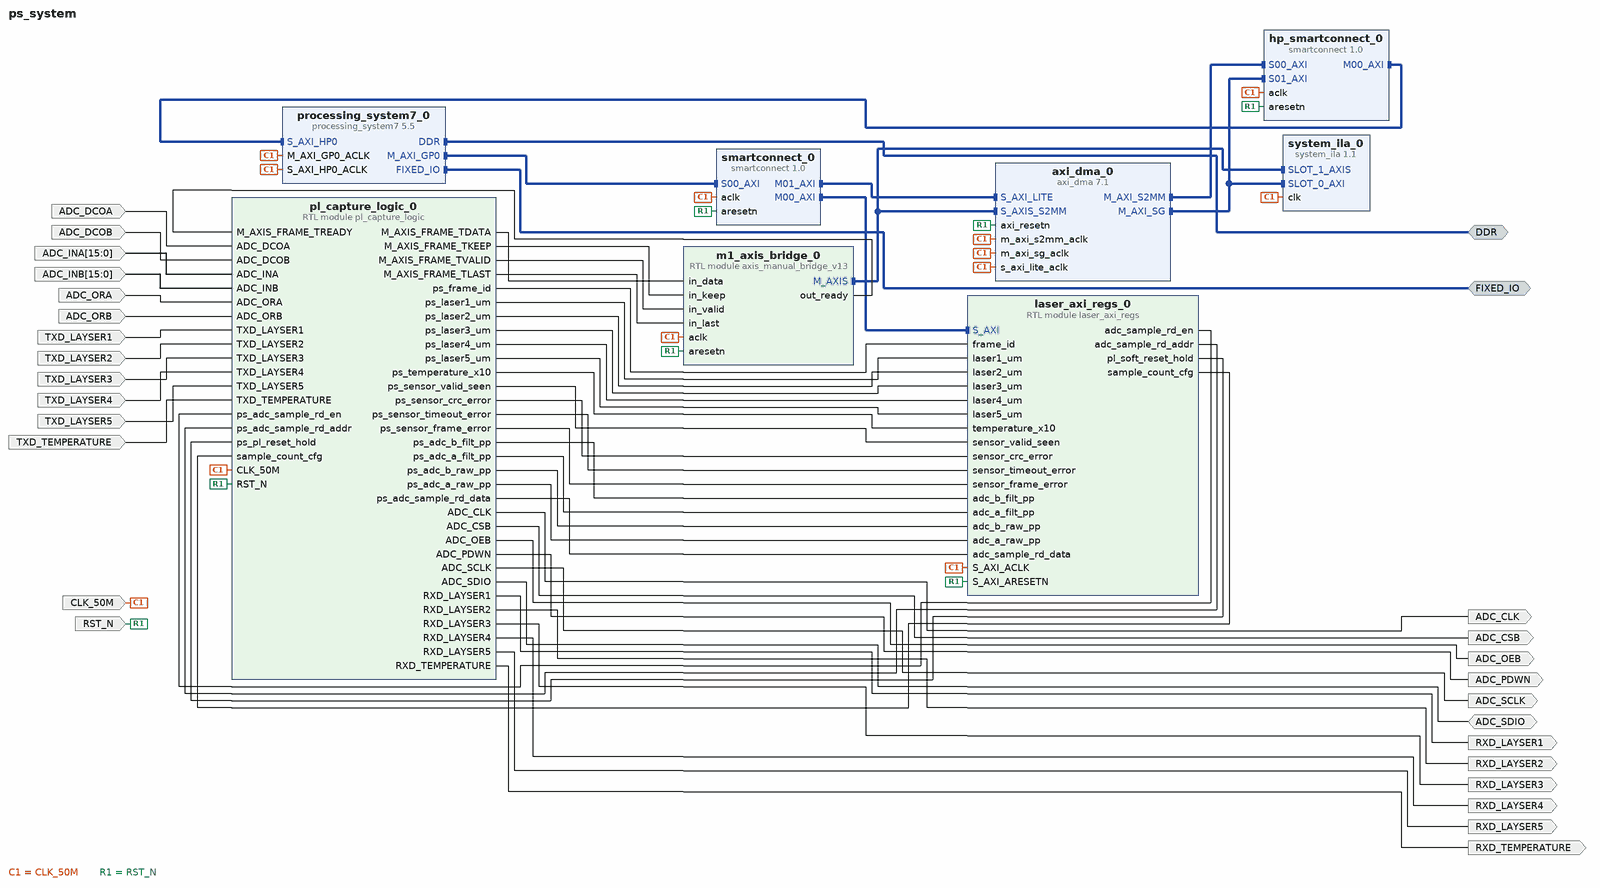
[diagram p0: block diagram of the top level]
# Vivado block design ps_system, xc7z020clg400-2, Vivado 2018.3
create_bd_design ps_system

create_bd_intf_port -mode Master -vlnv xilinx.com:interface:ddrx_rtl:1.0 DDR
create_bd_intf_port -mode Master -vlnv xilinx.com:display_processing_system7:fixedio_rtl:1.0 FIXED_IO
create_bd_port -dir O -type clk ADC_CLK
create_bd_port -dir O ADC_CSB
create_bd_port -dir I ADC_DCOA
create_bd_port -dir I ADC_DCOB
create_bd_port -dir I -from 15 -to 0 ADC_INA
create_bd_port -dir I -from 15 -to 0 ADC_INB
create_bd_port -dir O ADC_OEB
create_bd_port -dir I ADC_ORA
create_bd_port -dir I ADC_ORB
create_bd_port -dir O ADC_PDWN
create_bd_port -dir O ADC_SCLK
create_bd_port -dir IO ADC_SDIO
create_bd_port -dir O RXD_LAYSER1
create_bd_port -dir O RXD_LAYSER2
create_bd_port -dir O RXD_LAYSER3
create_bd_port -dir O RXD_LAYSER4
create_bd_port -dir O RXD_LAYSER5
create_bd_port -dir O RXD_TEMPERATURE
create_bd_port -dir I TXD_LAYSER1
create_bd_port -dir I TXD_LAYSER2
create_bd_port -dir I TXD_LAYSER3
create_bd_port -dir I TXD_LAYSER4
create_bd_port -dir I TXD_LAYSER5
create_bd_port -dir I TXD_TEMPERATURE
create_bd_port -dir I -type clk CLK_50M
set_property -dict {CONFIG.ASSOCIATED_RESET RST_N CONFIG.FREQ_HZ 50000000} [get_bd_ports CLK_50M]
create_bd_port -dir I -type rst RST_N
set_property -dict {CONFIG.POLARITY ACTIVE_LOW} [get_bd_ports RST_N]

create_bd_cell -type ip -vlnv xilinx.com:ip:processing_system7:5.5 processing_system7_0
set_property -dict [list \
  CONFIG.PCW_ENET0_ENET0_IO {MIO 16 .. 27} \
  CONFIG.PCW_ENET0_GRP_MDIO_ENABLE 1 \
  CONFIG.PCW_ENET0_GRP_MDIO_IO {MIO 52 .. 53} \
  CONFIG.PCW_ENET0_PERIPHERAL_ENABLE 1 \
  CONFIG.PCW_PRESET_BANK1_VOLTAGE {LVCMOS 1.8V} \
  CONFIG.PCW_QSPI_GRP_SINGLE_SS_ENABLE 1 \
  CONFIG.PCW_QSPI_GRP_SINGLE_SS_IO {MIO 1 .. 6} \
  CONFIG.PCW_QSPI_PERIPHERAL_ENABLE 1 \
  CONFIG.PCW_QSPI_QSPI_IO {MIO 1 .. 6} \
  CONFIG.PCW_SINGLE_QSPI_DATA_MODE x4 \
  CONFIG.PCW_UART1_PERIPHERAL_ENABLE 1 \
  CONFIG.PCW_UART1_UART1_IO {MIO 48 .. 49} \
  CONFIG.PCW_UART_PERIPHERAL_FREQMHZ 100 \
  CONFIG.PCW_UIPARAM_DDR_PARTNO {MT41J256M16 RE-125} \
  CONFIG.PCW_USE_S_AXI_HP0 1 \
] [get_bd_cells processing_system7_0]
# 106 more settings of processing_system7_0 are not shown: defaults, MIO pin electricals, DDR timing, and values the tool derives
create_bd_cell -type ip -vlnv xilinx.com:ip:smartconnect:1.0 smartconnect_0
set_property -dict {CONFIG.NUM_MI 2 CONFIG.NUM_SI 1} [get_bd_cells smartconnect_0]
create_bd_cell -type ip -vlnv xilinx.com:ip:axi_dma:7.1 axi_dma_0
set_property -dict [list \
  CONFIG.c_enable_multi_channel 0 \
  CONFIG.c_include_mm2s 0 \
  CONFIG.c_include_s2mm 1 \
  CONFIG.c_include_s2mm_dre 0 \
  CONFIG.c_include_sg 1 \
  CONFIG.c_m_axi_s2mm_data_width 64 \
  CONFIG.c_sg_include_stscntrl_strm 0 \
  CONFIG.c_sg_length_width 23 \
] [get_bd_cells axi_dma_0]
create_bd_cell -type ip -vlnv xilinx.com:ip:smartconnect:1.0 hp_smartconnect_0
set_property -dict {CONFIG.NUM_MI 1 CONFIG.NUM_SI 2} [get_bd_cells hp_smartconnect_0]
create_bd_cell -type module -reference axis_manual_bridge_v13 m1_axis_bridge_0
create_bd_cell -type ip -vlnv xilinx.com:ip:system_ila:1.1 system_ila_0
set_property -dict [list \
  CONFIG.C_DATA_DEPTH 8192 \
  CONFIG.C_NUM_MONITOR_SLOTS 2 \
  CONFIG.C_SLOT 0 \
  CONFIG.C_SLOT_1_INTF_TYPE xilinx.com:interface:axis_rtl:1.0 \
] [get_bd_cells system_ila_0]
create_bd_cell -type module -reference pl_capture_logic pl_capture_logic_0
create_bd_cell -type module -reference laser_axi_regs laser_axi_regs_0

# ---- connections ----

connect_bd_intf_net [get_bd_intf_pins processing_system7_0/M_AXI_GP0] [get_bd_intf_pins smartconnect_0/S00_AXI]
connect_bd_intf_net [get_bd_intf_pins axi_dma_0/M_AXI_S2MM] [get_bd_intf_pins hp_smartconnect_0/S00_AXI]
connect_bd_intf_net [get_bd_intf_pins smartconnect_0/M01_AXI] [get_bd_intf_pins axi_dma_0/S_AXI_LITE]
connect_bd_intf_net [get_bd_intf_pins m1_axis_bridge_0/M_AXIS] [get_bd_intf_pins axi_dma_0/S_AXIS_S2MM]
connect_bd_intf_net [get_bd_intf_pins m1_axis_bridge_0/M_AXIS] [get_bd_intf_pins system_ila_0/SLOT_1_AXIS]
connect_bd_intf_net [get_bd_intf_pins axi_dma_0/M_AXI_SG] [get_bd_intf_pins hp_smartconnect_0/S01_AXI]
connect_bd_intf_net [get_bd_intf_pins axi_dma_0/M_AXI_SG] [get_bd_intf_pins system_ila_0/SLOT_0_AXI]
connect_bd_intf_net [get_bd_intf_pins hp_smartconnect_0/M00_AXI] [get_bd_intf_pins processing_system7_0/S_AXI_HP0]
connect_bd_intf_net [get_bd_intf_pins smartconnect_0/M00_AXI] [get_bd_intf_pins laser_axi_regs_0/S_AXI]
connect_bd_intf_net [get_bd_intf_ports DDR] [get_bd_intf_pins processing_system7_0/DDR]
connect_bd_intf_net [get_bd_intf_ports FIXED_IO] [get_bd_intf_pins processing_system7_0/FIXED_IO]
connect_bd_net [get_bd_pins pl_capture_logic_0/ps_frame_id] [get_bd_pins laser_axi_regs_0/frame_id]
connect_bd_net [get_bd_pins pl_capture_logic_0/ps_laser1_um] [get_bd_pins laser_axi_regs_0/laser1_um]
connect_bd_net [get_bd_pins pl_capture_logic_0/ps_laser2_um] [get_bd_pins laser_axi_regs_0/laser2_um]
connect_bd_net [get_bd_pins pl_capture_logic_0/ps_laser3_um] [get_bd_pins laser_axi_regs_0/laser3_um]
connect_bd_net [get_bd_pins pl_capture_logic_0/ps_laser4_um] [get_bd_pins laser_axi_regs_0/laser4_um]
connect_bd_net [get_bd_pins pl_capture_logic_0/ps_laser5_um] [get_bd_pins laser_axi_regs_0/laser5_um]
connect_bd_net [get_bd_pins pl_capture_logic_0/ps_temperature_x10] [get_bd_pins laser_axi_regs_0/temperature_x10]
connect_bd_net [get_bd_pins pl_capture_logic_0/ps_sensor_valid_seen] [get_bd_pins laser_axi_regs_0/sensor_valid_seen]
connect_bd_net [get_bd_pins pl_capture_logic_0/ps_sensor_crc_error] [get_bd_pins laser_axi_regs_0/sensor_crc_error]
connect_bd_net [get_bd_pins pl_capture_logic_0/ps_sensor_timeout_error] [get_bd_pins laser_axi_regs_0/sensor_timeout_error]
connect_bd_net [get_bd_pins pl_capture_logic_0/ps_sensor_frame_error] [get_bd_pins laser_axi_regs_0/sensor_frame_error]
connect_bd_net -net CLK_50M_0_1 [get_bd_ports CLK_50M] \
  [get_bd_pins processing_system7_0/M_AXI_GP0_ACLK] [get_bd_pins smartconnect_0/aclk] [get_bd_pins axi_dma_0/s_axi_lite_aclk] \
  [get_bd_pins axi_dma_0/m_axi_sg_aclk] [get_bd_pins axi_dma_0/m_axi_s2mm_aclk] [get_bd_pins hp_smartconnect_0/aclk] \
  [get_bd_pins processing_system7_0/S_AXI_HP0_ACLK] [get_bd_pins m1_axis_bridge_0/aclk] [get_bd_pins system_ila_0/clk] \
  [get_bd_pins pl_capture_logic_0/CLK_50M] [get_bd_pins laser_axi_regs_0/S_AXI_ACLK]
connect_bd_net [get_bd_pins pl_capture_logic_0/ADC_CLK] [get_bd_ports ADC_CLK]
connect_bd_net [get_bd_pins pl_capture_logic_0/ADC_CSB] [get_bd_ports ADC_CSB]
connect_bd_net -net ADC_DCOA_0_1 [get_bd_ports ADC_DCOA] [get_bd_pins pl_capture_logic_0/ADC_DCOA]
connect_bd_net -net ADC_DCOB_0_1 [get_bd_ports ADC_DCOB] [get_bd_pins pl_capture_logic_0/ADC_DCOB]
connect_bd_net -net ADC_INA_0_1 [get_bd_ports ADC_INA] [get_bd_pins pl_capture_logic_0/ADC_INA]
connect_bd_net -net ADC_INB_0_1 [get_bd_ports ADC_INB] [get_bd_pins pl_capture_logic_0/ADC_INB]
connect_bd_net [get_bd_pins pl_capture_logic_0/ADC_OEB] [get_bd_ports ADC_OEB]
connect_bd_net -net ADC_ORA_0_1 [get_bd_ports ADC_ORA] [get_bd_pins pl_capture_logic_0/ADC_ORA]
connect_bd_net -net ADC_ORB_0_1 [get_bd_ports ADC_ORB] [get_bd_pins pl_capture_logic_0/ADC_ORB]
connect_bd_net [get_bd_pins pl_capture_logic_0/ADC_PDWN] [get_bd_ports ADC_PDWN]
connect_bd_net [get_bd_pins pl_capture_logic_0/ADC_SCLK] [get_bd_ports ADC_SCLK]
connect_bd_net [get_bd_ports ADC_SDIO] [get_bd_pins pl_capture_logic_0/ADC_SDIO]
connect_bd_net [get_bd_pins pl_capture_logic_0/RXD_LAYSER1] [get_bd_ports RXD_LAYSER1]
connect_bd_net [get_bd_pins pl_capture_logic_0/RXD_LAYSER2] [get_bd_ports RXD_LAYSER2]
connect_bd_net [get_bd_pins pl_capture_logic_0/RXD_LAYSER3] [get_bd_ports RXD_LAYSER3]
connect_bd_net [get_bd_pins pl_capture_logic_0/RXD_LAYSER4] [get_bd_ports RXD_LAYSER4]
connect_bd_net [get_bd_pins pl_capture_logic_0/RXD_LAYSER5] [get_bd_ports RXD_LAYSER5]
connect_bd_net [get_bd_pins pl_capture_logic_0/RXD_TEMPERATURE] [get_bd_ports RXD_TEMPERATURE]
connect_bd_net -net TXD_LAYSER1_0_1 [get_bd_ports TXD_LAYSER1] [get_bd_pins pl_capture_logic_0/TXD_LAYSER1]
connect_bd_net -net TXD_LAYSER2_0_1 [get_bd_ports TXD_LAYSER2] [get_bd_pins pl_capture_logic_0/TXD_LAYSER2]
connect_bd_net -net TXD_LAYSER3_0_1 [get_bd_ports TXD_LAYSER3] [get_bd_pins pl_capture_logic_0/TXD_LAYSER3]
connect_bd_net -net TXD_LAYSER4_0_1 [get_bd_ports TXD_LAYSER4] [get_bd_pins pl_capture_logic_0/TXD_LAYSER4]
connect_bd_net -net TXD_LAYSER5_0_1 [get_bd_ports TXD_LAYSER5] [get_bd_pins pl_capture_logic_0/TXD_LAYSER5]
connect_bd_net -net TXD_TEMPERATURE_0_1 [get_bd_ports TXD_TEMPERATURE] [get_bd_pins pl_capture_logic_0/TXD_TEMPERATURE]
connect_bd_net [get_bd_ports RST_N] \
  [get_bd_pins smartconnect_0/aresetn] [get_bd_pins axi_dma_0/axi_resetn] [get_bd_pins hp_smartconnect_0/aresetn] \
  [get_bd_pins m1_axis_bridge_0/aresetn] [get_bd_pins pl_capture_logic_0/RST_N] [get_bd_pins laser_axi_regs_0/S_AXI_ARESETN]
connect_bd_net [get_bd_pins pl_capture_logic_0/ps_adc_b_filt_pp] [get_bd_pins laser_axi_regs_0/adc_b_filt_pp]
connect_bd_net [get_bd_pins pl_capture_logic_0/ps_adc_a_filt_pp] [get_bd_pins laser_axi_regs_0/adc_a_filt_pp]
connect_bd_net [get_bd_pins pl_capture_logic_0/ps_adc_b_raw_pp] [get_bd_pins laser_axi_regs_0/adc_b_raw_pp]
connect_bd_net [get_bd_pins pl_capture_logic_0/ps_adc_a_raw_pp] [get_bd_pins laser_axi_regs_0/adc_a_raw_pp]
connect_bd_net [get_bd_pins laser_axi_regs_0/adc_sample_rd_en] [get_bd_pins pl_capture_logic_0/ps_adc_sample_rd_en]
connect_bd_net [get_bd_pins laser_axi_regs_0/adc_sample_rd_addr] [get_bd_pins pl_capture_logic_0/ps_adc_sample_rd_addr]
connect_bd_net [get_bd_pins pl_capture_logic_0/ps_adc_sample_rd_data] [get_bd_pins laser_axi_regs_0/adc_sample_rd_data]
connect_bd_net [get_bd_pins laser_axi_regs_0/pl_soft_reset_hold] [get_bd_pins pl_capture_logic_0/ps_pl_reset_hold]
connect_bd_net -net m1_pl_axis_tdata [get_bd_pins pl_capture_logic_0/M_AXIS_FRAME_TDATA] [get_bd_pins m1_axis_bridge_0/in_data]
connect_bd_net -net m1_pl_axis_tkeep [get_bd_pins pl_capture_logic_0/M_AXIS_FRAME_TKEEP] [get_bd_pins m1_axis_bridge_0/in_keep]
connect_bd_net -net m1_pl_axis_tvalid [get_bd_pins pl_capture_logic_0/M_AXIS_FRAME_TVALID] [get_bd_pins m1_axis_bridge_0/in_valid]
connect_bd_net -net m1_pl_axis_tready [get_bd_pins m1_axis_bridge_0/out_ready] [get_bd_pins pl_capture_logic_0/M_AXIS_FRAME_TREADY]
connect_bd_net -net m1_pl_axis_tlast [get_bd_pins pl_capture_logic_0/M_AXIS_FRAME_TLAST] [get_bd_pins m1_axis_bridge_0/in_last]
connect_bd_net [get_bd_pins laser_axi_regs_0/sample_count_cfg] [get_bd_pins pl_capture_logic_0/sample_count_cfg]

# ---- address map ----
assign_bd_address -offset 0x00000000 -range 1G -target_address_space [get_bd_addr_spaces axi_dma_0/Data_S2MM] [get_bd_addr_segs processing_system7_0/S_AXI_HP0/HP0_DDR_LOWOCM]
assign_bd_address -offset 0x00000000 -range 1G -target_address_space [get_bd_addr_spaces axi_dma_0/Data_SG] [get_bd_addr_segs processing_system7_0/S_AXI_HP0/HP0_DDR_LOWOCM]
assign_bd_address -offset 0x40400000 -range 64K -target_address_space [get_bd_addr_spaces processing_system7_0/Data] [get_bd_addr_segs axi_dma_0/S_AXI_LITE/Reg]
assign_bd_address -offset 0x43C00000 -range 64K -target_address_space [get_bd_addr_spaces processing_system7_0/Data] [get_bd_addr_segs laser_axi_regs_0/S_AXI/reg0]

validate_bd_design
save_bd_design
